# Altium schematic sheet MR_Motor.SchDoc
size A4; CompanyName: BeeIonic; SheetNumber: 2; SheetTotal: 7
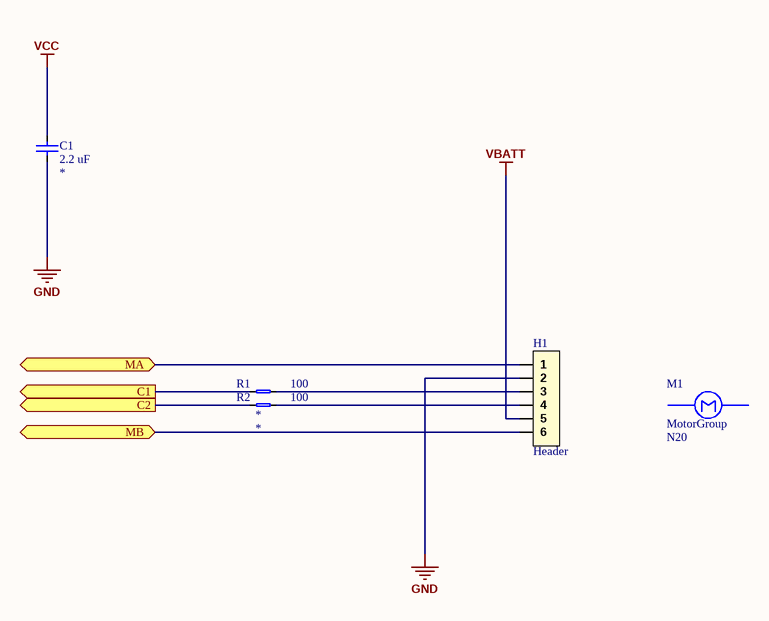
[diagram p0: MR_Motor.SchDoc]

## Parts
C1  value 2.2 uF  [0603_CAP_LD]  (hidden comment: CerCap)
H1  Header  [HEADER_1X6_PICOBLADE_653106124022]
M1  MotorGroup  Reference: N20  [MotorGroup]
R1  value 100  [0603_RES_LD]  (hidden comment: Resistor)
R2  value 100  [0603_RES_LD]  (hidden comment: Resistor)

## Ports
C1 (out), C2 (out), MA (bidir), MB (bidir)

## Nets
GND: C1.2 H1.2
VBATT: H1.5
VCC: C1.1
C1: R1.1 ; port C1
C2: R2.2 ; port C2
MA: H1.1 ; port MA
MB: H1.6 ; port MB
NetH1_3: H1.3 R1.2
NetH1_4: H1.4 R2.1

## Notes on the sheet
- Project :
- Title :
- Sheet:
- of
- Creation Date :
- Designer :
- Modified Date :

## Library data of the parts
C1 = CerCap: Ceramic Capacitor; Type: *; Voltage/Power: *; Package: *
H1 = Header_6x1: Header 6x1 Pins
M1 = Motor
R1 R2 = Resistor: Precision: *; Package: *